# EAGLE design OledAdapter (EAGLE 7.3.0)
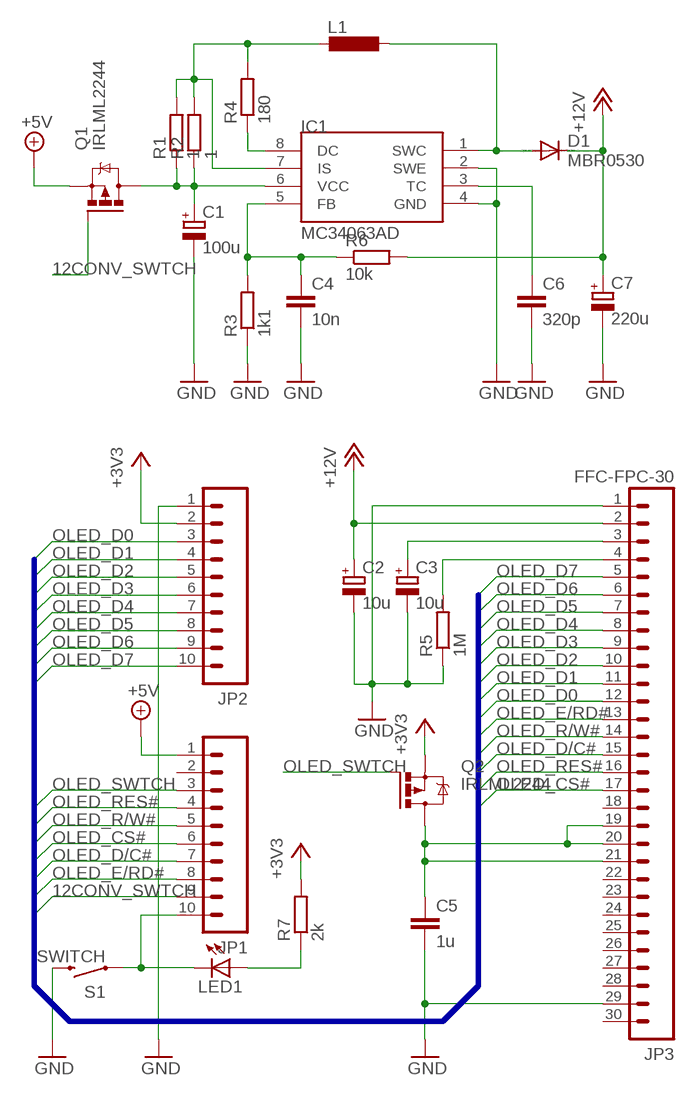
[diagram p0: schematic, sheet 1]

## Parts
C1  100u  CPOL-EUUD-6,3X7,7  [UD-6,3X7,7_NICHICON]
C2  10u  CPOL-EUUD-4X5,8  [UD-4X5,8_NICHICON]
C3  10u  CPOL-EUUD-4X5,8  [UD-4X5,8_NICHICON]
C4  10n  C-EUC0805  [C0805]
C5  1u  C-EUC1206  [C1206]
C6  320p  C-EUC0805  [C0805]
C7  220u  CPOL-EUUD-6,3X7,7  [UD-6,3X7,7_NICHICON]
D1  MBR0530  MBR0520LT  [SOD123]
IC1  MC34063AD  [SOIC8]
JP1  M10SILK_FEMALE_PTH  [1X10]
JP2  M10SILK_FEMALE_PTH  [1X10]
JP3  FFC-FPC-30  [FFC-FPC-30V]
L1  L-EUL8530M  [L8530M]
LED1  LEDSML1206  [SML1206]
Q1  IRLML2244  IRLML5203  [MICRO3]
Q2  IRLML2244  IRLML5203  [MICRO3]
R1  1  R-EU_R0805  [R0805]
R2  1  R-EU_R0805  [R0805]
R3  1k1  R-EU_R0805  [R0805]
R4  180  R-EU_R0805  [R0805]
R5  1M  R-EU_M1206  [M1206]
R6  10k  R-EU_R0805  [R0805]
R7  2k  R-EU_R0805  [R0805]
S1  SWITCH  SWITCH-MOMENTARY-2SMD-1101NE  [TACTILE-SWITCH-1101NE]

## Nets
12CONV_SWTCH: JP1.9 Q1.1(G)
+3V3: JP2.2 Q2.2(S) R7.2
+5V: JP1.1 Q1.2(S)
+12V: C2.+ C7.+ D1.C JP3.2 R6.2
GND: C1.- C2.- C3.- C4.2 C5.2 C6.2 C7.- IC1.2(SWE) IC1.4(GND) JP2.1 JP3.1 JP3.29 R3.1 R5.1 S1.2
N$2: JP1.10 LED1.C S1.1
N$3: LED1.A R7.1
N$18: C1.+ IC1.6(VCC) Q1.3(D) R1.1 R2.1
N$19: C3.+ JP3.3
N$20: C5.1 JP3.19 JP3.20 JP3.21 Q2.3(D)
N$21: IC1.7(IS) L1.2 R1.2 R2.2 R4.2
N$22: JP3.4 R5.2
N$23: IC1.8(DC) R4.1
N$24: D1.A IC1.1(SWC) L1.1
N$25: C6.1 IC1.3(TC)
N$26: C4.1 IC1.5(FB) R3.2 R6.1
OLED_CS#: JP1.6 JP3.17
OLED_D0: JP2.3 JP3.12
OLED_D1: JP2.4 JP3.11
OLED_D2: JP2.5 JP3.10
OLED_D3: JP2.6 JP3.9
OLED_D4: JP2.7 JP3.8
OLED_D5: JP2.8 JP3.7
OLED_D6: JP2.9 JP3.6
OLED_D7: JP2.10 JP3.5
OLED_D/C#: JP1.7 JP3.15
OLED_E/RD#: JP1.8 JP3.13
OLED_R/W#: JP1.5 JP3.14
OLED_RES#: JP1.4 JP3.16
OLED_SWTCH: JP1.3 Q2.1(G)
Unconnected: JP1.2 JP3.18 JP3.22 JP3.23 JP3.24 JP3.25 JP3.26 JP3.27 JP3.28 JP3.30

## Buses
B$2

## Library data of the parts
C1-C3 C7 = rcl:CPOL-EU: POLARIZED CAPACITOR, European symbol
C4-C6 = rcl:C-EU: CAPACITOR, European symbol
D1 = diode:MBR0520LT: SCHOTTKY BARRIER RECTIFIER Source: http://onsemi.com .. MBR0520LT1-D.pdf
IC1 = mc34063:MC34063
JP1 JP2 = SparkFun-Connectors:M10: Header 10 Standard 10-pin 0.1" header. Use with straight break away headers (SKU : PRT-00116), right angle break away headers (PRT-00553), swiss pins (PRT-00743), machine pins (PRT-00117), and female headers (PRT-00115).; PROD_ID: CONN-11563
JP3 = Misc:FFC-FPC-30
L1 = rcl:L-EU: INDUCTOR, European symbol
LED1 = led:LED: LED OSRAM: - CHIPLED LG R971, LG N971, LY N971, LG Q971, LY Q971, LO R971, LY R971 LH N974, LH R974 LS Q976, LO Q976, LY Q976 LO Q996 - Hyper CHIPLED LW Q18S LB Q993, LB Q99A, LB R99A - SideLED LS A670, LO A670, LY A670, LG A670, LP A670 LB A673, LV A673, LT A673, LW A673 LH A674 LY A675 LS A676, LA A676, LO A676, LY A676, LW A676 LS A679, LY A679, LG A679 - Hyper Micro SIDELED® LS Y876, LA Y876, LO Y876, LY Y876 LT Y87S - SmartLED LW L88C, LW L88S LB L89C, LB L89S, LG L890 LS L89K, LO L89K, LY L89K LS L896, LA L896, LO L896, LY L896 - TOPLED LS T670, LO T670, LY T670, LG T670, LP T670 LSG T670, LSP T670, LSY T670, LOP T670, LYG T670 LG T671, LOG T671, LSG T671 LB T673, LV T673, LT T673, LW T673 LH T674 LS T676, LA T676, LO T676, LY T676, LB T676, LH T676, LSB T676, LW T676 LB T67C, LV T67C, LT T67C, LS T67K, LO T67K, LY T67K, LW E67C LS E67B, LA E67B, LO E67B, LY E67B, LB E67C, LV E67C, LT E67C LW T67C LS T679, LY T679, LG T679 LS T770, LO T770, LY T770, LG T770, LP T770 LB T773, LV T773, LT T773, LW T773 LH T774 LS E675, LA E675, LY E675, LS T675 LS T776, LA T776, LO T776, LY T776, LB T776 LHGB T686 LT T68C, LB T68C - Hyper Mini TOPLED® LB M676 - Mini TOPLED Santana® LG M470 LS M47K, LO M47K, LY M47K Source: http://www.osram.convergy.de LUXEON: - LUMILED® LXK2-PW12-R00, LXK2-PW12-S00, LXK2-PW14-U00, LXK2-PW14-V00 LXK2-PM12-R00, LXK2-PM12-S00, LXK2-PM14-U00 LXK2-PE12-Q00, LXK2-PE12-R00, LXK2-PE12-S00, LXK2-PE14-T00, LXK2-PE14-U00 LXK2-PB12-K00, LXK2-PB12-L00, LXK2-PB12-M00, LXK2-PB14-N00, LXK2-PB14-P00, LXK2-PB14-Q00 LXK2-PR12-L00, LXK2-PR12-M00, LXK2-PR14-Q00, LXK2-PR14-R00 LXK2-PD12-Q00, LXK2-PD12-R00, LXK2-PD12-S00 LXK2-PH12-R00, LXK2-PH12-S00 LXK2-PL12-P00, LXK2-PL12-Q00, LXK2-PL12-R00 Source: www.luxeon.com KINGBRIGHT: KA-3528ASYC Source: www.kingbright.com
Q1 Q2 = transistor-power:IRLML5203: HEXFET P-Channel Power MOSFET
R1-R7 = rcl:R-EU_: RESISTOR, European symbol
S1 = SparkFun-Electromechanical:SWITCH-MOMENTARY-2: Various NO switches- pushbuttons, reed, etc; PROD_ID: SWCH-00815

## Board
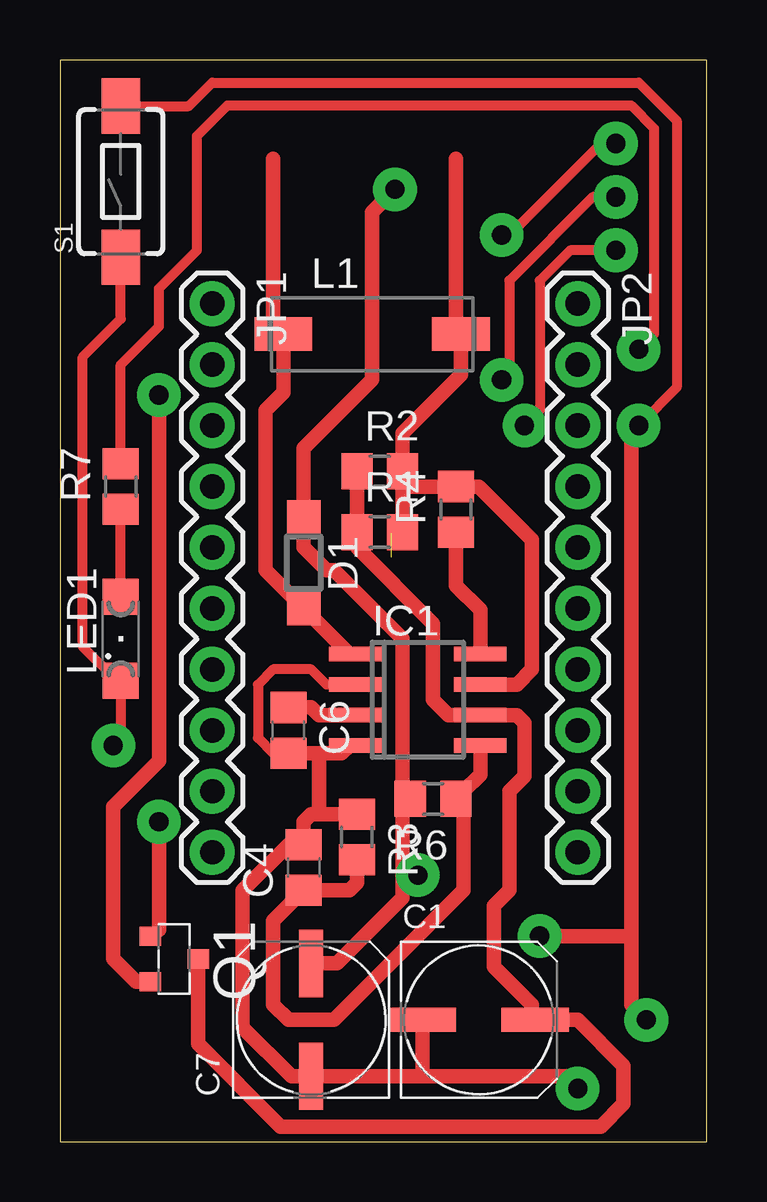
[diagram p1: board, top side]
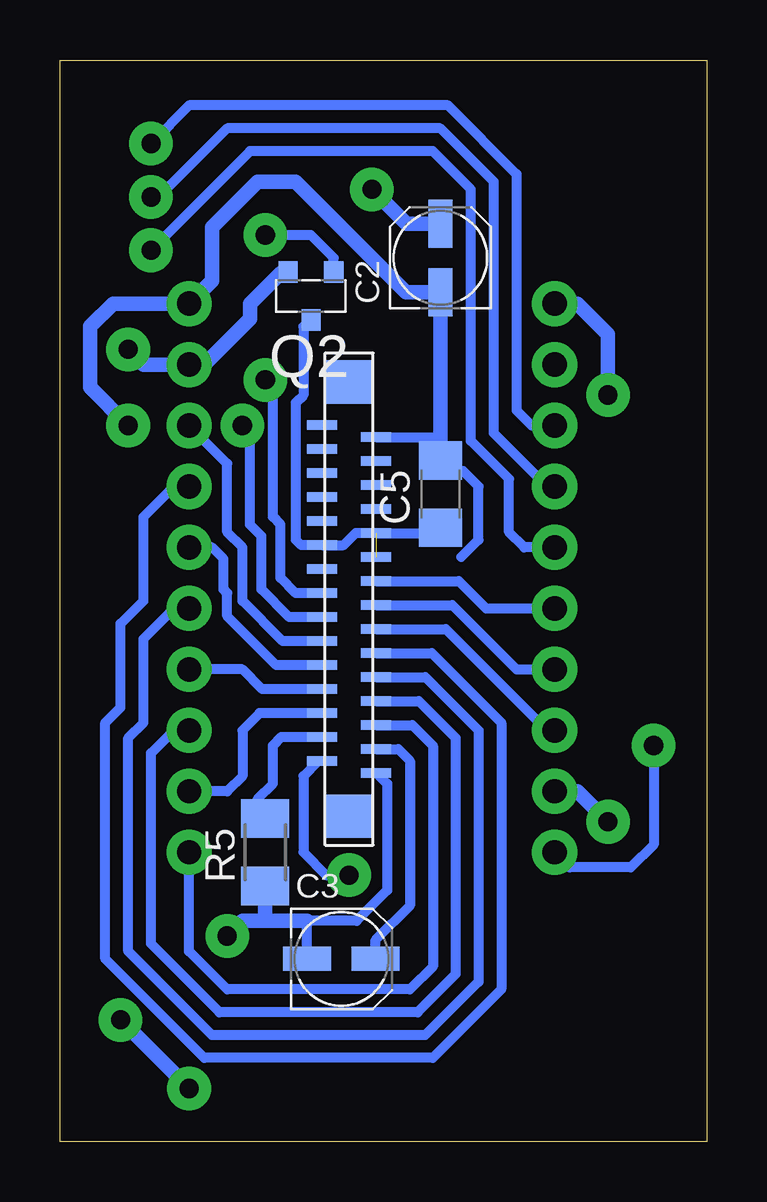
[diagram p2: board, bottom side, seen from below]

Size 26.98 x 45.08 mm. Coordinates in mm from the lower left corner, seen from the top.
Outline: 0,0 26.98,0 26.98,45.08 0,45.08 0,0
Copper layers (1*16): Top 0.035mm / dielectric 1.5mm / Bottom 0.035mm
Design rules "default *": minimum track width 10mil, minimum drill 24mil, track to track 8mil, track to pad 8mil, pad to pad 8mil, via to via 8mil, smd to smd 8mil, copper to edge 40mil, drill to drill 8mil, minimum pad ring 15mil, minimum via ring 20mil, stop-mask expansion 4mil, vias tented up to drill 0mil, thermal gap 10mil

### Footprints (pad centres in the part's own frame; a part is rotated, then mirrored left to right if it is on the bottom)
UD-6,3X7,7_NICHICON = smd 2.8 x 1: + 2.35,0; - -2.35,0
UD-4X5,8_NICHICON = smd 2 x 1: + 1.425,0; - -1.425,0
C0805 = smd 1.3 x 1.5: 1 -0.95,0; 2 0.95,0
C1206 = smd 1.6 x 1.8: 1 -1.4,0; 2 1.4,0
SOD123 = smd 1.4 x 1.4: A 1.9,0; C -1.9,0
SOIC8 = smd 0.6 x 2.2: 1 -1.905,-2.6; 2 -0.635,-2.6; 3 0.635,-2.6; 4 1.905,-2.6; 5 1.905,2.6; 6 0.635,2.6; 7 -0.635,2.6; 8 -1.905,2.6
1X10 = drill 1.016 pad 1.88: 1 0,0; 2 2.54,0; 3 5.08,0; 4 7.62,0; 5 10.16,0; 6 12.7,0; 7 15.24,0; 8 17.78,0; 9 20.32,0; 10 22.86,0
FFC-FPC-30V = smd 0.4 x 1.25: 1 -7.5,-1.125; 2 -7,1.125; 3 -6.5,-1.125; 4 -6,1.125; 5 -5.5,-1.125; 6 -5,1.125; 7 -4.5,-1.125; 8 -4,1.125; 9 -3.5,-1.125; 10 -3,1.125; 11 -2.5,-1.125; 12 -2,1.125; 13 -1.5,-1.125; 14 -1,1.125; 15 -0.5,-1.125; 16 0,1.125; 17 0.5,-1.125; 18 1,1.125; 19 1.5,-1.125; 20 2,1.125; 21 2.5,-1.125; 22 3,1.125; 23 3.5,-1.125; 24 4,1.125; 25 4.5,-1.125; 26 5,1.125; 27 5.5,-1.125; 28 6,1.125; 29 6.5,-1.125; 30 7,1.125 | smd 1.8 x 2: P$1 -9.3,0; P$2 8.8,0
L8530M = smd 2.4 x 1.4: 1 -3.7,0; 2 3.7,0
SML1206 = smd 1.5 x 1.5: A 1.75,0; C -1.75,0
MICRO3 = smd 0.8 x 0.9: 1 -0.95,-1; 2 0.95,-1; 3 0,1
R0805 = smd 1.3 x 1.5: 1 -0.95,0; 2 0.95,0
M1206 = smd 1.6 x 2: 1 -1.4,0; 2 1.4,0
TACTILE-SWITCH-1101NE = smd 2.3 x 1.6: 1 -3.15,0; 2 3.15,0

### Placement (x,y rotation side)
C1  17.46,5.08 0 top
C2  11.11,36.83 90 bottom
C3  15.24,7.62 0 bottom
C4  10.16,11.43 90 top
C5  11.11,26.99 90 bottom
C6  9.53,17.14 270 top
C7  10.48,5.08 90 top
D1  10.16,24.13 270 top
IC1  14.92,18.41 270 top
JP1  6.35,34.92 270 top
JP2  21.59,34.92 270 top
JP3  14.92,22.86 90 bottom
L1  13.02,33.66 0 top
LED1  2.54,20.95 90 top
Q1  4.76,7.62 270 top
Q2  16.51,35.24 180 bottom
R1  13.34,25.4 0 top
R2  13.34,27.94 0 top
R3  12.38,12.7 270 top
R4  16.51,26.35 90 top
R5  18.41,12.06 90 bottom
R6  15.56,14.29 180 top
R7  2.54,27.3 90 top
S1  2.54,40.01 90 top

### Tracks (layer width: path | path; a pad name or v marks a point on that pad's centre or on a via)
12CONV_SWTCH  (via drill 0.8)
  Top 0.61: v4.13,13.34 4.13,8.84 Q1.1
  Bottom 0.61: JP1.9 5.4,14.61 v4.13,13.34
+3V3  (via drill 0.8)
  Top 0.406: R7.2 2.54,32.38 4.13,33.97 4.13,35.56 5.71,37.15 5.71,41.91 6.99,43.18 23.81,43.18 24.77,42.23 24.77,33.66 v24.13,33.02
  Bottom 0.406: Q2.2 17.78,36.2
  Bottom 0.61: 17.78,36.2 19.05,34.92 19.05,34.29 20.95,32.38 JP2.2 23.5,32.38 v24.13,33.02
+5V  (via drill 0.8)
  Top 0.61: Q1.2 3.17,6.67 2.22,7.62 2.22,13.97 4.13,15.88 v4.13,31.11
  Bottom 0.61: JP1.1 5.4,34.92 4.13,33.66 v4.13,31.11
+12V  (via drill 0.8)
  Top 0.61: v13.97,39.69 13.02,38.73 13.02,31.75 10.16,28.89 D1.C 10.16,24.77 11.11,23.81 11.43,23.81 14.29,20.95 14.29,14.29 | 14.29,14.29 14.29,11.11 | 14.29,11.11 v14.92,11.11 | R6.2 14.29,14.29 | C7.+ 11.56,7.43 14.29,10.16 14.29,11.11
  Bottom 0.406: JP3.2 16.21,15.86 16.83,15.24 16.83,12.06 15.88,11.11 v14.92,11.11
  Bottom 0.61: C2.+ 12.54,38.26 v13.97,39.69
GND  (via drill 0.8)
  Top 0.406: IC1.2 11.11,19.05 10.48,19.68 8.89,19.68 8.26,19.05 8.26,16.83 8.89,16.19 C6.2 | S1.2 5.37,43.16 6.35,44.13 24.13,44.13 25.72,42.55 25.72,31.43 v24.13,29.84
  Top 0.61: v24.13,29.84 23.81,29.53 23.81,8.57 | 23.81,8.57 23.81,5.71 v24.45,5.08 | 23.81,8.57 v20,8.57 | IC1.4 12.06,16.51 11.75,16.19 11.74,16.2 10.79,16.2 | C6.2 10.79,16.2 | 10.79,13.65 10.48,13.65 10.16,13.34 C4.2 9.53,12.38 7.62,10.48 7.62,4.76 9.65,2.73 C7.- 15.24,2.73 | 10.79,13.65 R3.1 11.75,13.65 | 10.79,16.2 10.79,13.65 | 14.61,5.08 C1.- 15.11,2.86 15.24,2.73 | 15.24,2.73 21.08,2.73 v21.59,2.22
  Bottom 0.406: JP3.1 13.77,15.36 13.34,14.92 13.34,10.48 14.61,9.21 16.66,9.21 C3.- | JP3.29 11.26,29.36 11.11,29.21 | 10.25,24.36 9.53,25.08 9.53,27.3 10.16,27.94 10.79,27.94 C5.2
  Bottom 0.61: C5.2 11.11,29.21 C2.- 12.54,35.41 17.14,40.01 18.73,40.01 20.64,38.1 20.64,35.88 JP2.1 24.77,34.92 25.72,33.97 25.72,31.43 v24.13,29.84 | v24.45,5.08 v21.59,2.22 | v20,8.57 19.37,9.21 18.41,9.21 | 18.41,9.21 16.66,9.21 | R5.1 18.41,9.21
N$2  (via drill 0.8)
  Top 0.406: S1.1 2.54,34.29 0.95,32.7 0.95,20.64 2.38,19.2 LED1.C 2.54,16.83 v2.22,16.51
  Bottom 0.406: v2.22,16.51 2.22,12.38 3.17,11.43 5.71,11.43 JP1.10
N$3
  Top 0.406: LED1.A R7.1
N$4
  Top 0.61: 8.89,33.66 8.89,40.96
N$5
  Top 0.61: 16.51,33.97 16.51,40.96
N$18
  Top 0.61: R2.1 R1.1 12.38,24.77 15.56,21.59 15.56,18.41 16.19,17.78 IC1.6 19.05,17.78 19.37,17.46 19.37,15.24 18.73,14.61 18.73,10.48 18.1,9.84 18.1,7.3 19.68,5.71 19.68,5.08 C1.+ 21.59,5.08 23.5,3.17 23.5,1.59 22.54,0.64 9.21,0.64 5.76,4.08 Q1.3
N$19
  Bottom 0.406: JP3.3 12.87,16.36 12.38,15.88 12.38,9.84 13.81,8.41 C3.+
N$20  (1 unrouted)
  Bottom 0.406: C5.1 11.79,25.36 JP3.21 14.64,25.36 15.14,24.86 JP3.20 16.92,24.86 17.14,25.08 17.14,30.8 16.83,31.11 16.83,33.97 16.56,34.24 Q2.3
N$21
  Top 0.61: 14.29,27.3 R2.2 14.29,29.53 16.72,31.96 L1.2 | 14.29,27.3 14.29,26.04 | 14.29,26.04 R1.2 | 14.29,26.03 14.29,26.04 | IC1.7 19.05,19.05 19.68,19.68 19.68,25.08 17.46,27.3 R4.2 14.29,27.3
N$22
  Bottom 0.406: R5.2 18.41,13.34 18.73,13.02 18.73,14.29 18.1,14.92 18.1,16.51 17.75,16.86 JP3.4
N$23
  Top 0.61: R4.1 16.51,23.18 17.52,22.16 IC1.8
N$24
  Top 0.61: IC1.1 12.07,20.32 D1.A 8.57,23.81 8.57,30.48 9.32,31.23 L1.1
N$25
  Top 0.61: C6.1 9.65,18.1 10.48,18.1 10.79,17.78 IC1.3
N$26
  Top 0.61: IC1.5 17.52,15.3 16.82,14.6 R6.1 16.83,14.29 16.83,13.34 16.82,10.47 11.43,5.08 9.53,5.08 8.89,5.71 8.89,9.21 C4.1 12.07,10.48 12.38,10.79 R3.2
OLED_CS#
  Bottom 0.406: JP3.17 10.34,23.36 9.21,22.23 JP1.6
OLED_D0
  Bottom 0.406: JP3.12 17.68,20.86 19.37,22.54 19.37,24.77 20,25.4 20,28.26 JP2.3
OLED_D1
  Bottom 0.406: JP3.11 11.47,20.36 8.57,17.46 8.57,6.35 11.43,3.49 20.95,3.49 25.08,7.62 25.08,17.46 24.45,18.1 24.45,21.59 23.5,22.54 23.5,26.04 22.23,27.3 JP2.4
OLED_D2
  Bottom 0.406: JP3.10 17.95,19.86 20,21.91 20,22.86 20.16,23.02 20.16,24.29 20.64,24.77 JP2.5
OLED_D3
  Bottom 0.406: JP3.9 11.74,19.36 9.53,17.14 9.53,6.67 11.75,4.45 20.64,4.45 24.13,7.94 24.13,16.83 23.5,17.46 23.5,20.95 22.23,22.23 JP2.6
OLED_D4
  Bottom 0.406: JP3.8 18.54,18.86 19.37,19.68 JP2.7
OLED_D5
  Bottom 0.406: JP3.7 12.01,18.36 10.48,16.83 10.48,6.99 12.06,5.4 20.32,5.4 23.18,8.26 23.18,16.19 22.23,17.14 JP2.8
OLED_D6
  Bottom 0.406: JP3.6 18.65,17.86 19.37,17.14 19.37,15.24 20,14.61 JP2.9
OLED_D7
  Bottom 0.406: JP3.5 12.28,17.36 11.43,16.51 11.43,7.3 12.38,6.35 20,6.35 21.59,7.94 JP2.10
OLED_D/C#
  Bottom 0.406: JP3.15 10.61,22.36 7.94,19.68 JP1.7
OLED_E/RD#
  Bottom 0.406: JP3.13 10.88,21.36 6.67,17.14 JP1.8
OLED_R/W#  (via drill 0.8)
  Top 0.406: v23.18,37.15 21.27,37.15 20,35.88 20,30.48 v19.37,29.84
  Bottom 0.406: JP3.14 17.41,21.86 18.57,23.02 18.57,25.24 19.05,25.72 19.05,29.53 v19.37,29.84 | JP1.5 7.62,24.77 8.26,25.4 8.26,27.62 9.84,29.21 9.84,39.69 11.43,41.27 19.05,41.27 v23.18,37.15
OLED_RES#  (via drill 0.8)
  Top 0.406: v23.18,39.37 22.23,39.37 18.73,35.88 18.73,32.07 v18.41,31.75
  Bottom 0.406: JP1.4 6.67,27.3 8.89,29.53 8.89,40.01 11.11,42.23 20,42.23 22.86,39.37 v23.18,39.37 | JP3.16 17.14,22.86 17.78,23.5 17.78,25.72 18.1,26.04 18.1,31.43 v18.41,31.75
OLED_SWTCH  (via drill 0.8)
  Top 0.406: v23.18,41.59 22.54,41.59 18.73,37.78 v18.41,37.78
  Bottom 0.406: v23.18,41.59 21.59,43.18 10.79,43.18 7.94,40.32 7.94,30.48 7.3,29.84 JP1.3 | Q2.1 15.56,36.83 16.51,37.78 v18.41,37.78